# Altium schematic sheet ST_LINK.SchDoc
size A4
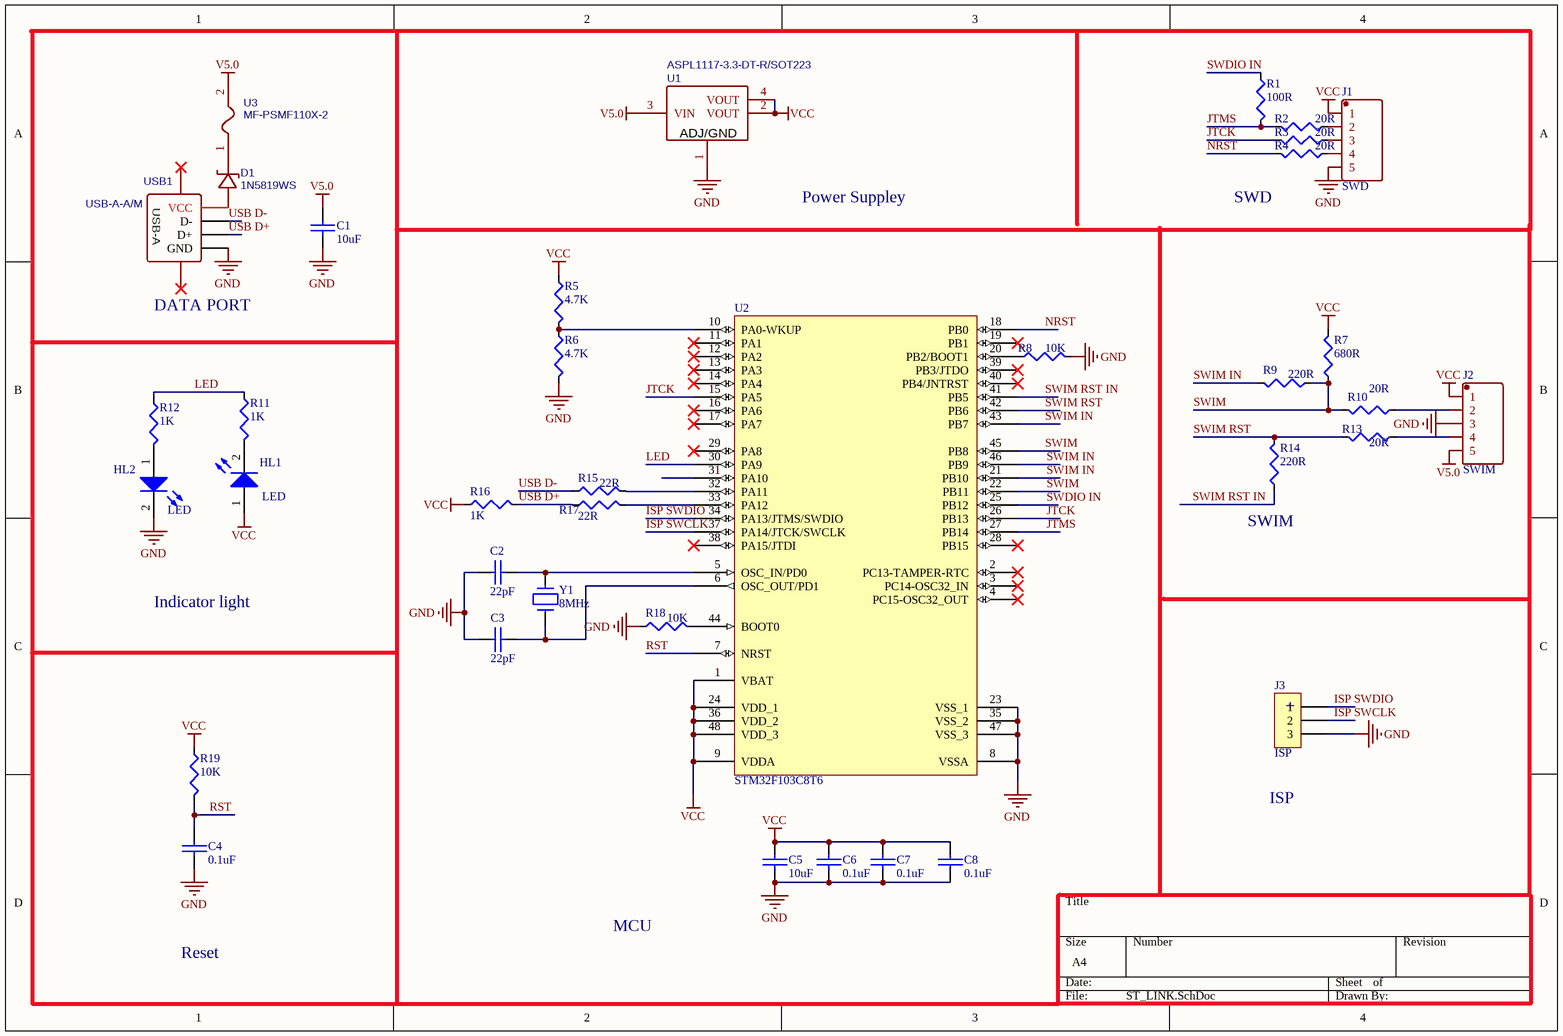
[diagram p0: ST_LINK.SchDoc]

## Parts
C1  10uF  [0603-C]
C2  22pF  [0603-C]
C3  22pF  [0603-C]
C4  0.1uF  [0603-C]
C5  10uF  [0603-C]
C6  0.1uF  [0603-C]
C7  0.1uF  [0603-C]
C8  0.1uF  [0603-C]
D1  1N5819WS  [SOD-323_L1.8-W1.3-LS2.5-RD]
HL1  LED  [LED-0805]
HL2  LED  [LED-0805]
J1  SWD  [牛角座]
J2  SWIM  [牛角座]
J3  ISP  [CON-3*2.54]
R1  100R  [R-0603]
R2  20R  [R-0603]
R3  20R  [R-0603]
R4  20R  [R-0603]
R5  4.7K  [R-0603]
R6  4.7K  [R-0603]
R7  680R  [R-0603]
R8  10K  [R-0603]
R9  220R  [R-0603]
R10  20R  [R-0603]
R11  1K  [R-0603]
R12  1K  [R-0603]
R13  20R  [R-0603]
R14  220R  [R-0603]
R15  22R  [R-0603]
R16  1K  [R-0603]
R17  22R  [R-0603]
R18  10K  [R-0603]
R19  10K  [R-0603]
U1  ASPL1117-3.3-DT-R/SOT223  [SOT223]
U2  STM32F103C8T6  [LQFP-48_L7.0-W7.0-P0.50-LS9.0-BL]
U3  MF-PSMF110X-2  [F0805]
USB1  USB-A-A/M  [USB-A-SMD_USB-A-1-TH]
Y1  8MHz  [8M-crystals]

## Nets
GND: C1.1 C2.2 C3.1 C4.2 C5.1 C6.2 C7.2 C8.2 HL2.2(K) J1.5 J2.3 J3.3 R6.2 R8.2 R18.1 U1.1(ADJ/GND) U2.8(VSSA) U2.23(VSS_1) U2.35(VSS_2) U2.47(VSS_3) USB1.4(GND)
V5.0: C1.2 J2.5 U1.3(VIN) U3.2
VCC: C5.2 C6.1 C7.1 C8.1 HL1.1(A) J1.1 J2.1 R5.1 R7.2 R16.1 R19.1 U1.2(VOUT) U1.4(VOUT) U2.1(VBAT) U2.9(VDDA) U2.24(VDD_1) U2.36(VDD_2) U2.48(VDD_3)
ISP SWCLK: J3.2 U2.37(PA14/JTCK/SWCLK)
ISP SWDIO: J3.1 U2.34(PA13/JTMS/SWDIO)
JTCK: R3.2 U2.15(PA5) U2.26(PB13)
JTMS: R1.2 R2.2 U2.27(PB14)
LED: R11.1 R12.1 U2.30(PA9)
NRST: R4.2 U2.18(PB0)
RST: C4.1 R19.2 U2.7(NRST)
SWDIO IN: R1.1 U2.25(PB12)
SWIM: R7.1 R9.1 R10.2 U2.22(PB11) U2.45(PB8)
SWIM IN: R9.2 U2.21(PB10) U2.43(PB7) U2.46(PB9)
SWIM RST: R13.2 R14.2 U2.42(PB6)
SWIM RST IN: R14.1 U2.41(PB5)
USB D+: R16.2 R17.1 USB1.3(D+)
USB D-: R15.1 USB1.2(D-)
NetC2_1: C2.1 U2.5(OSC_IN/PD0) Y1.2
NetC3_2: C3.2 U2.6(OSC_OUT/PD1) Y1.1
NetD1_1: D1.1(C) U3.1
NetD1_2: D1.2(A) USB1.1(VCC)
NetHL1_2: HL1.2(K) R11.2
NetHL2_1: HL2.1(A) R12.2
NetJ1_2: J1.2 R2.1
NetJ1_3: J1.3 R3.1
NetJ1_4: J1.4 R4.1
NetJ2_2: J2.2 R10.1
NetJ2_4: J2.4 R13.1
NetR5_2: R5.2 R6.1 U2.10(PA0-WKUP)
NetR8_1: R8.1 U2.20(PB2/BOOT1)
NetR15_2: R15.2 U2.32(PA11)
NetR17_2: R17.2 U2.33(PA12)
NetR18_2: R18.2 U2.44(BOOT0)

Not connected (* = marked no-connect by the designer): U2 2(PC13-TAMPER-RTC)* 3(PC14-OSC32_IN)* 4(PC15-OSC32_OUT)* 11(PA1)* 12(PA2)* 13(PA3)* 14(PA4)* 16(PA6)* 17(PA7)* 19(PB1)* 28(PB15)* 29(PA8)* 31(PA10) 38(PA15/JTDI)* 39(PB3/JTDO)* 40(PB4/JNTRST)*; USB1 5* 6*

## Notes on the sheet
- Power Suppley
- SWD
- (near USB1) DATA PORT
- (near R14) SWIM
- Indicator light
- ISP
- Reset
- MCU
- (in symbol CON-3*2.54) +
- (in symbol USB-A-A/M Stick plate bent legs VinylPBT With a column) USB-A

## Library data of the parts
C1-C8 = C-0603
D1 = 1N5819WS: BOM_Manufacturer: Guangdong Hottech; Contributor: LCSC; SMT Type: Extend; BOM_Supplier: LCSC; BOM_Supplier Part: C191023; BOM_Manufacturer Part: 1N5819WS; BOM_LCSC Assembly: Yes; spicePre: D; spiceSymbolName: 1N5819WS
HL1 HL2 = LED-0805-BLUE
J1 J2 = CON-5*2.54
J3 = CON-3*2.54
R1-R19 = R-0603
U1 = ASPL1117-3.3-DT-R/SOT223: BOM_Manufacturer: Ascend; Contributor: LCSC; BOM_Supplier: LCSC; BOM_Supplier Part: C520553; BOM_Manufacturer Part: ASPL1117-3.3-DT-R/SOT223; spicePre: U; spiceSymbolName: ASPL1117-3.3-DT-R/SOT223
U3 = MF-PSMF110X-2: BOM_Manufacturer: BOURNS; SMT Type: Extend; BOM_Supplier: LCSC; BOM_Manufacturer Part: MF-PSMF110X-2; BOM_Supplier Part: C89658; BOM_LCSC Assembly: Yes; spicePre: U; spiceSymbolName: MF-PSMF110X-2
USB1 = USB-A-A/M Stick plate bent legs VinylPBT With a column: BOM_Manufacturer: ValuePro; BOM_Supplier: LCSC; BOM_Manufacturer Part: A/M Stick plate bent legs VinylPBT With a column; image: //image.lceda.cn/szlcsc/C46394.jpg; BOM_Supplier Part: C46394; spicePre: U; spiceSymbolName: USB-A-A/M Stick plate bent legs VinylPBT With a column
Y1 = XTAT